# Altium schematic sheet LED Inducator.SchDoc: MCU LED Layer
size 292 x 193 mm; SheetNumber: 4; SheetTotal: 5
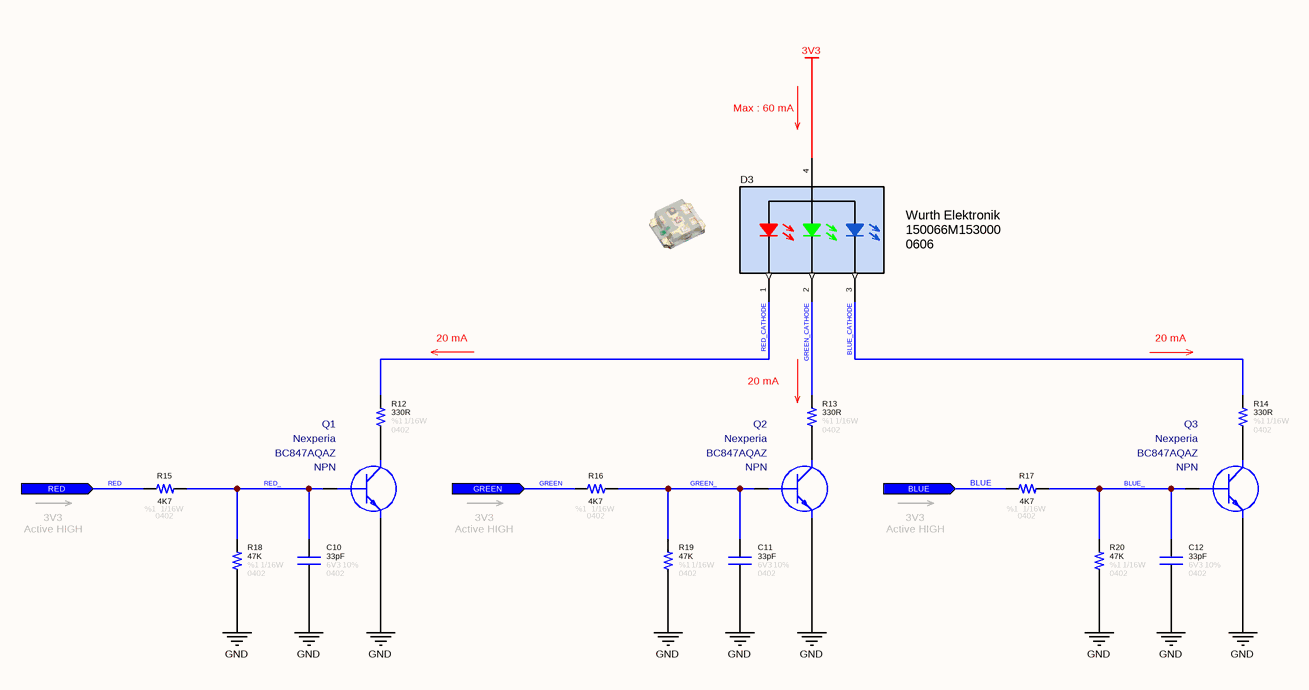
[diagram p0: LED Inducator.SchDoc]

## Parts
C10  value 33pF  Tolerance: 10%  Case: 0402  Voltage: 6V3  [CAPACITOR_0402]
C11  value 33pF  Tolerance: 10%  Case: 0402  Voltage: 6V3  [CAPACITOR_0402]
C12  value 33pF  Tolerance: 10%  Case: 0402  Voltage: 6V3  [CAPACITOR_0402]
D3  Manufacturer Name: Wurth Elektronik  Manufacturer Part Number: 150066M153000  Case: 0606  [Wurth_0606]
Q1  Manufacturer Name: Nexperia  Manufacturer Part Number: BC847AQAZ  Polarity: NPN  [SOT1215]
Q2  Manufacturer Name: Nexperia  Manufacturer Part Number: BC847AQAZ  Polarity: NPN  [SOT1215]
Q3  Manufacturer Name: Nexperia  Manufacturer Part Number: BC847AQAZ  Polarity: NPN  [SOT1215]
R12  value 330R  Case: 0402  Tolerance: %1  Power: 1/16W  [RESISTOR_0402]
R13  value 330R  Case: 0402  Tolerance: %1  Power: 1/16W  [RESISTOR_0402]
R14  value 330R  Case: 0402  Tolerance: %1  Power: 1/16W  [RESISTOR_0402]
R15  value 4K7  Tolerance: %1  Case: 0402  Power: 1/16W  [RESISTOR_0402]
R16  value 4K7  Tolerance: %1  Case: 0402  Power: 1/16W  [RESISTOR_0402]
R17  value 4K7  Tolerance: %1  Case: 0402  Power: 1/16W  [RESISTOR_0402]
R18  value 47K  Tolerance: %1  Case: 0402  Power: 1/16W  [RESISTOR_0402]
R19  value 47K  Tolerance: %1  Case: 0402  Power: 1/16W  [RESISTOR_0402]
R20  value 47K  Tolerance: %1  Case: 0402  Power: 1/16W  [RESISTOR_0402]

## Ports
BLUE (in), GREEN (in), RED (in)

## Nets
3V3: D3.4
GND: C10.1 C11.1 C12.1 Q1.2(E) Q2.2(E) Q3.2(E) R18.1 R19.1 R20.1
BLUE: R17.2 ; port BLUE
BLUE_: C12.2 Q3.1(B) R17.1 R20.2
BLUE_CATHODE: D3.3 R14.2
GREEN: R16.2 ; port GREEN
GREEN_: C11.2 Q2.1(B) R16.1 R19.2
GREEN_CATHODE: D3.2 R13.2
RED: R15.2 ; port RED
RED_: C10.2 Q1.1(B) R15.1 R18.2
RED_CATHODE: D3.1 R12.2
NetQ1_3: Q1.3(C) R12.1
NetQ2_3: Q2.3(C) R13.1
NetQ3_3: Q3.3(C) R14.1

## Notes on the sheet
- Max : 60 mA
- 20 mA
- (near R13) 20 mA
- 3V3
  Active HIGH
- © 2021 All rights reserved.
  This document may not, in whole or in part, be copied, photocopied, reproduced, translated or converted to any electronic or machine readable from without prior written permission of Mehmet Günce Akkoyun.
  Engineer contact : akkoyun@me.com
- Property of
- Engineer :
- Date :
- Size :
- A4
- Time :
- Project :
- Page :
- /
- Customer :
- Product ID :
- Module ID :
- Version :
- File :
- Revision :

## Library data of the parts
C10-C12 = Capacitor - 33pF [0402-6V3]: Capacitor - 33pF [0402] (Ceramic); Manufacturer Name: Kemet; Manufacturer Part Number: C0402C330J9RACAUTO; ComponentLink1Description: DataSheet; ComponentLink1URL: https://api.kemet.com/component-edge/download/datasheet/C0402C330J9RACAUTO.pdf; ComponentLink2Description: Mouser; ComponentLink2URL: https://www.mouser.com/Search/Refine.aspx?Keyword=80-C0402C330J9RAUTO
D3 = Diode - LED-RGB: LED RGB DIFFUSED SMD; If - Forward Current: 20 mA; Vf - Forward Voltage: 2 V, 3.3 V; Product Type: LED; Minimum Operating Temperature: - 40 C; Maximum Operating Temperature: + 85 C; ROHS: Yes
Q1-Q3 = Transistor - BC847: Bipolar NPN Transistors; Case: DFN-1010D-3
R12-R14 = Resistor - 330R [0402]: Thick Film Resistors - SMD 1/16 W 330 Ohm 1%; Manufacturer Name: Vishay; Manufacturer Part Number: CRCW0402330RFKED; ComponentLink1Description: DataSheet; ComponentLink1URL: https://www.mouser.com.tr/datasheet/2/427/dcrcwe3-1762152.pdf; ComponentLink2Description: Mouser; ComponentLink2URL: https://www.mouser.com.tr/ProductDetail/Vishay-Dale/CRCW0402330RFKED?qs=sGAEpiMZZMu61qfTUdNhG2DpbjADlD3GGS6SwBlLi5Q%3D
R15-R17 = Resistor - 4K7 [0402]: Thick Film Resistors - SMD 1/16 W 4.7 KOhm 1%; Manufacturer Name: Vishay; Manufacturer Part Number: CRCW04024K70FKED; ComponentLink1Description: DataSheet; ComponentLink1URL: https://www.mouser.com.tr/datasheet/2/427/dcrcwe3-1762152.pdf; ComponentLink2Description: Mouser; ComponentLink2URL: https://www.mouser.com.tr/ProductDetail/Vishay-Dale/CRCW04024K70FKED?qs=sGAEpiMZZMu61qfTUdNhG7nHf%2F6MTUn3HadIdDQu24Q%3D
R18-R20 = Resistor - 47K [0402]: Thick Film Resistors - SMD 1/16 W 47 KOhm 1%; Manufacturer Name: Vishay; Manufacturer Part Number: CRCW040247K0FKED; ComponentLink1Description: DataSheet; ComponentLink1URL: https://www.mouser.com.tr/datasheet/2/427/dcrcwe3-1762152.pdf; ComponentLink2Description: Mouser; ComponentLink2URL: https://www.mouser.com.tr/ProductDetail/Vishay-Dale/CRCW040247K0FKED?qs=sGAEpiMZZMu61qfTUdNhG2DpbjADlD3GL%252B3h1elTxqU%3D